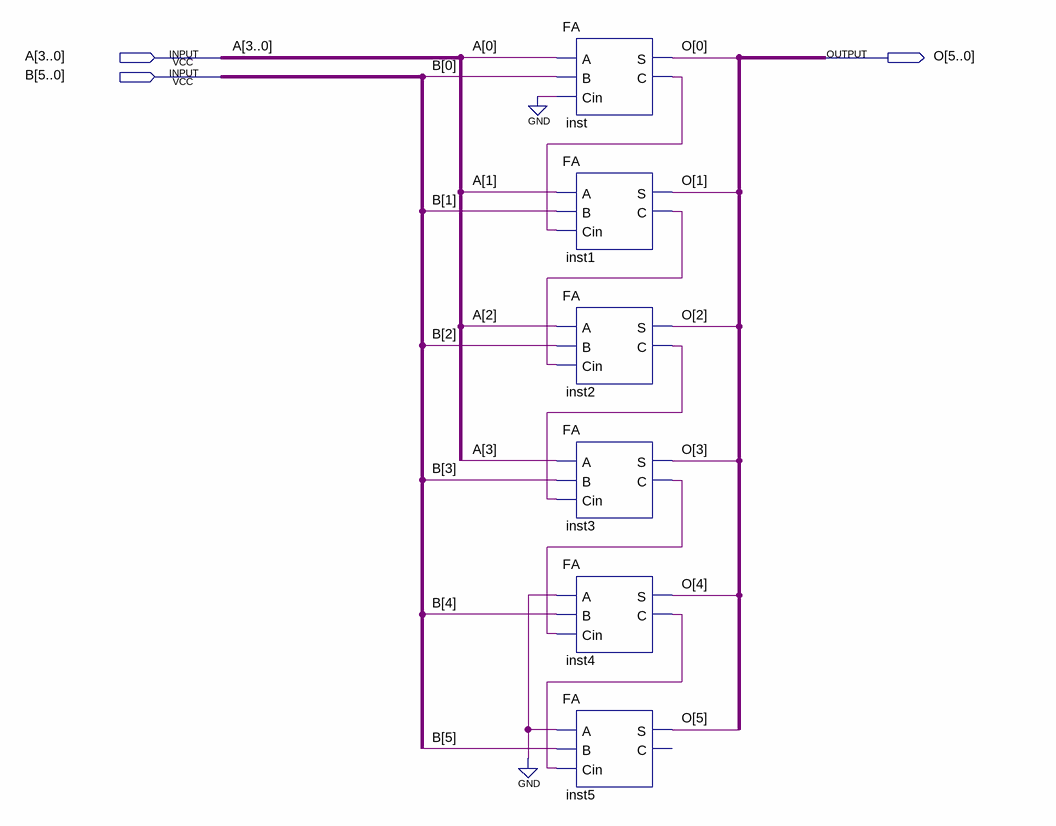
[diagram p0: schematic sheet]
// Quartus schematic Adder6.bdf as structural Verilog: 6 symbols, 3 pins
module Adder6 (
  input  [3:0] A,
  input  [5:0] B,
  output [5:0] O
);

  wire inst1_c, inst2_c, inst3_c, inst4_c, inst_c;

  FA inst (.A(A[0]), .B(B[0]), .Cin(1'b0), .S(O[0]), .C(inst_c));
  FA inst1 (.A(A[1]), .B(B[1]), .Cin(inst_c), .S(O[1]), .C(inst1_c));
  FA inst2 (.A(A[2]), .B(B[2]), .Cin(inst1_c), .S(O[2]), .C(inst2_c));
  FA inst3 (.A(A[3]), .B(B[3]), .Cin(inst2_c), .S(O[3]), .C(inst3_c));
  FA inst4 (.A(1'b0), .B(B[4]), .Cin(inst3_c), .S(O[4]), .C(inst4_c));
  FA inst5 (.A(1'b0), .B(B[5]), .Cin(inst4_c), .S(O[5]));  // open: C
endmodule
